# EAGLE schematic OpenAGBoardPart2 (EAGLE 7.5.0)
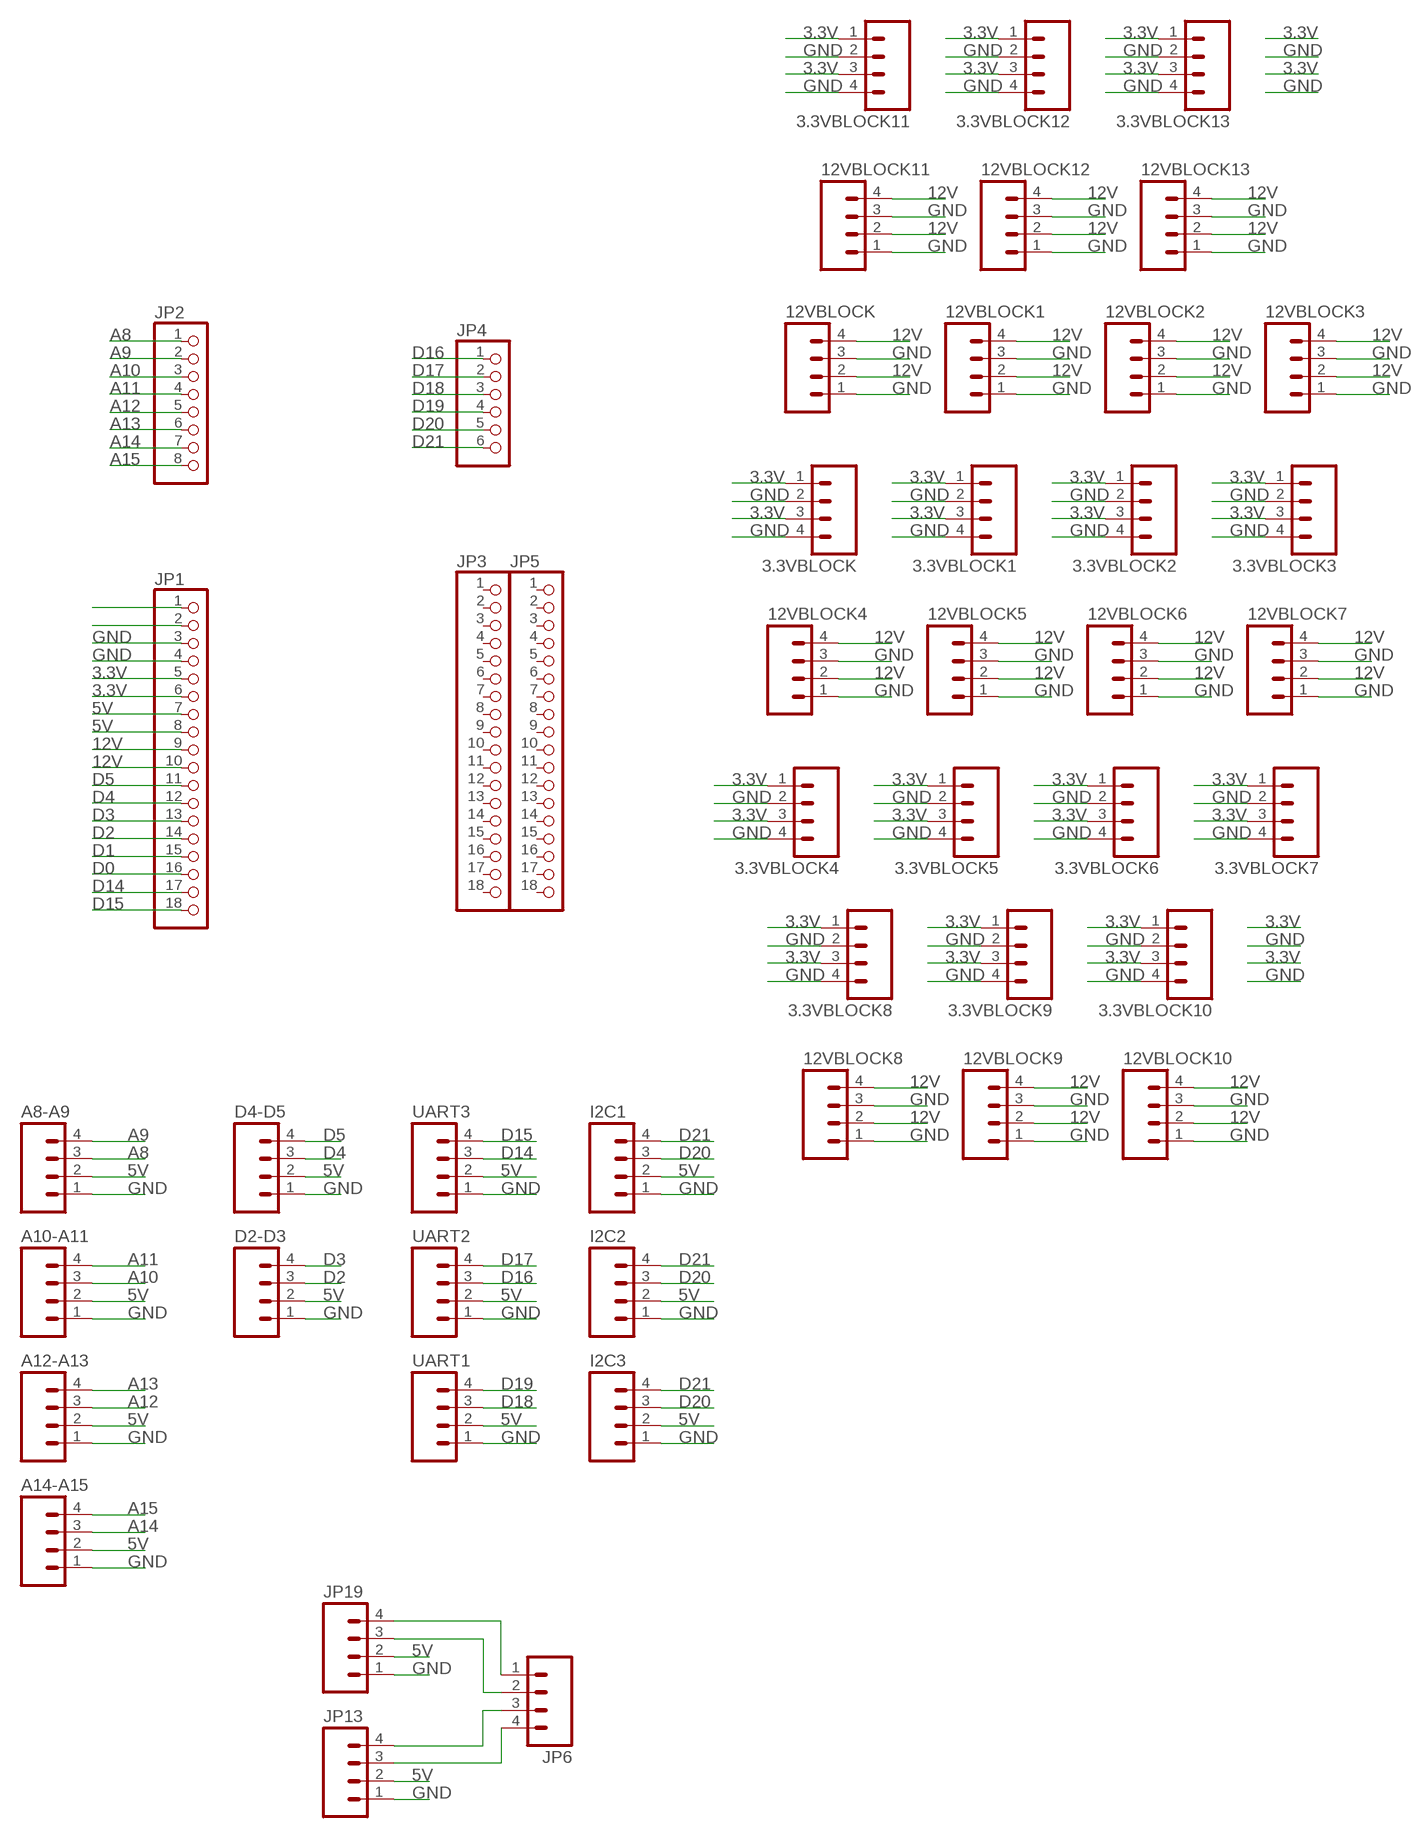
[diagram p0: schematic, sheet 1]

## Parts
3.3VBLOCK  M04NO_SILK_ALL_ROUND  [1X04_NO_SILK_ALL_ROUND]
3.3VBLOCK1  M04NO_SILK_ALL_ROUND  [1X04_NO_SILK_ALL_ROUND]
3.3VBLOCK2  M04NO_SILK_ALL_ROUND  [1X04_NO_SILK_ALL_ROUND]
3.3VBLOCK3  M04NO_SILK_ALL_ROUND  [1X04_NO_SILK_ALL_ROUND]
3.3VBLOCK4  M04NO_SILK_ALL_ROUND  [1X04_NO_SILK_ALL_ROUND]
3.3VBLOCK5  M04NO_SILK_ALL_ROUND  [1X04_NO_SILK_ALL_ROUND]
3.3VBLOCK6  M04NO_SILK_ALL_ROUND  [1X04_NO_SILK_ALL_ROUND]
3.3VBLOCK7  M04NO_SILK_ALL_ROUND  [1X04_NO_SILK_ALL_ROUND]
3.3VBLOCK8  M04NO_SILK_ALL_ROUND  [1X04_NO_SILK_ALL_ROUND]
3.3VBLOCK9  M04NO_SILK_ALL_ROUND  [1X04_NO_SILK_ALL_ROUND]
3.3VBLOCK10  M04NO_SILK_ALL_ROUND  [1X04_NO_SILK_ALL_ROUND]
3.3VBLOCK11  M04NO_SILK_ALL_ROUND  [1X04_NO_SILK_ALL_ROUND]
3.3VBLOCK12  M04NO_SILK_ALL_ROUND  [1X04_NO_SILK_ALL_ROUND]
3.3VBLOCK13  M04NO_SILK_ALL_ROUND  [1X04_NO_SILK_ALL_ROUND]
12VBLOCK  M04NO_SILK_ALL_ROUND  [1X04_NO_SILK_ALL_ROUND]
12VBLOCK1  M04NO_SILK_ALL_ROUND  [1X04_NO_SILK_ALL_ROUND]
12VBLOCK2  M04NO_SILK_ALL_ROUND  [1X04_NO_SILK_ALL_ROUND]
12VBLOCK3  M04NO_SILK_ALL_ROUND  [1X04_NO_SILK_ALL_ROUND]
12VBLOCK4  M04NO_SILK_ALL_ROUND  [1X04_NO_SILK_ALL_ROUND]
12VBLOCK5  M04NO_SILK_ALL_ROUND  [1X04_NO_SILK_ALL_ROUND]
12VBLOCK6  M04NO_SILK_ALL_ROUND  [1X04_NO_SILK_ALL_ROUND]
12VBLOCK7  M04NO_SILK_ALL_ROUND  [1X04_NO_SILK_ALL_ROUND]
12VBLOCK8  M04NO_SILK_ALL_ROUND  [1X04_NO_SILK_ALL_ROUND]
12VBLOCK9  M04NO_SILK_ALL_ROUND  [1X04_NO_SILK_ALL_ROUND]
12VBLOCK10  M04NO_SILK_ALL_ROUND  [1X04_NO_SILK_ALL_ROUND]
12VBLOCK11  M04NO_SILK_ALL_ROUND  [1X04_NO_SILK_ALL_ROUND]
12VBLOCK12  M04NO_SILK_ALL_ROUND  [1X04_NO_SILK_ALL_ROUND]
12VBLOCK13  M04NO_SILK_ALL_ROUND  [1X04_NO_SILK_ALL_ROUND]
A8-A9  M04NO_SILK_ALL_ROUND  [1X04_NO_SILK_ALL_ROUND]
A10-A11  M04NO_SILK_ALL_ROUND  [1X04_NO_SILK_ALL_ROUND]
A12-A13  M04NO_SILK_ALL_ROUND  [1X04_NO_SILK_ALL_ROUND]
A14-A15  M04NO_SILK_ALL_ROUND  [1X04_NO_SILK_ALL_ROUND]
D2-D3  M04NO_SILK_ALL_ROUND  [1X04_NO_SILK_ALL_ROUND]
D4-D5  M04NO_SILK_ALL_ROUND  [1X04_NO_SILK_ALL_ROUND]
I2C1  M04NO_SILK_ALL_ROUND  [1X04_NO_SILK_ALL_ROUND]
I2C2  M04NO_SILK_ALL_ROUND  [1X04_NO_SILK_ALL_ROUND]
I2C3  M04NO_SILK_ALL_ROUND  [1X04_NO_SILK_ALL_ROUND]
JP1  PINHD-1X18-BIG  [1X18-BIG]
JP2  PINHD-1X8BIG  [1X08-BIG]
JP3  PINHD-1X18-BIG  [1X18-BIG]
JP4  PINHD-1X6B  [1X06-BIG]
JP5  PINHD-1X18-BIG  [1X18-BIG]
JP6  M04PTH  [1X04]
JP13  M04NO_SILK_ALL_ROUND  [1X04_NO_SILK_ALL_ROUND]
JP19  M04NO_SILK_ALL_ROUND  [1X04_NO_SILK_ALL_ROUND]
UART1  M04NO_SILK_ALL_ROUND  [1X04_NO_SILK_ALL_ROUND]
UART2  M04NO_SILK_ALL_ROUND  [1X04_NO_SILK_ALL_ROUND]
UART3  M04NO_SILK_ALL_ROUND  [1X04_NO_SILK_ALL_ROUND]

## Nets
3.3V: 3.3VBLOCK1.1 3.3VBLOCK1.3 3.3VBLOCK2.1 3.3VBLOCK2.3 3.3VBLOCK3.1 3.3VBLOCK3.3 3.3VBLOCK4.1 3.3VBLOCK4.3 3.3VBLOCK5.1 3.3VBLOCK5.3 3.3VBLOCK6.1 3.3VBLOCK6.3 3.3VBLOCK7.1 3.3VBLOCK7.3 3.3VBLOCK8.1 3.3VBLOCK8.3 3.3VBLOCK9.1 3.3VBLOCK9.3 3.3VBLOCK10.1 3.3VBLOCK10.3 3.3VBLOCK11.1 3.3VBLOCK11.3 3.3VBLOCK12.1 3.3VBLOCK12.3 3.3VBLOCK13.1 3.3VBLOCK13.3 3.3VBLOCK.1 3.3VBLOCK.3 JP1.5 JP1.6
5V: A8-A9.2 A10-A11.2 A12-A13.2 A14-A15.2 D2-D3.2 D4-D5.2 I2C1.2 I2C2.2 I2C3.2 JP1.7 JP1.8 JP13.2 JP19.2 UART1.2 UART2.2 UART3.2
12V: 12VBLOCK1.2 12VBLOCK1.4 12VBLOCK2.2 12VBLOCK2.4 12VBLOCK3.2 12VBLOCK3.4 12VBLOCK4.2 12VBLOCK4.4 12VBLOCK5.2 12VBLOCK5.4 12VBLOCK6.2 12VBLOCK6.4 12VBLOCK7.2 12VBLOCK7.4 12VBLOCK8.2 12VBLOCK8.4 12VBLOCK9.2 12VBLOCK9.4 12VBLOCK10.2 12VBLOCK10.4 12VBLOCK11.2 12VBLOCK11.4 12VBLOCK12.2 12VBLOCK12.4 12VBLOCK13.2 12VBLOCK13.4 12VBLOCK.2 12VBLOCK.4 JP1.9 JP1.10
A8: A8-A9.3 JP2.1
A9: A8-A9.4 JP2.2
A10: A10-A11.3 JP2.3
A11: A10-A11.4 JP2.4
A12: A12-A13.3 JP2.5
A13: A12-A13.4 JP2.6
A14: A14-A15.3 JP2.7
A15: A14-A15.4 JP2.8
D0: JP1.16
D1: JP1.15
D2: D2-D3.3 JP1.14
D3: D2-D3.4 JP1.13
D4: D4-D5.3 JP1.12
D5: D4-D5.4 JP1.11
D14: JP1.17 UART3.3
D15: JP1.18 UART3.4
D16: JP4.1 UART2.3
D17: JP4.2 UART2.4
D18: JP4.3 UART1.3
D19: JP4.4 UART1.4
D20: I2C1.3 I2C2.3 I2C3.3 JP4.5
D21: I2C1.4 I2C2.4 I2C3.4 JP4.6
GND: 3.3VBLOCK1.2 3.3VBLOCK1.4 3.3VBLOCK2.2 3.3VBLOCK2.4 3.3VBLOCK3.2 3.3VBLOCK3.4 3.3VBLOCK4.2 3.3VBLOCK4.4 3.3VBLOCK5.2 3.3VBLOCK5.4 3.3VBLOCK6.2 3.3VBLOCK6.4 3.3VBLOCK7.2 3.3VBLOCK7.4 3.3VBLOCK8.2 3.3VBLOCK8.4 3.3VBLOCK9.2 3.3VBLOCK9.4 3.3VBLOCK10.2 3.3VBLOCK10.4 3.3VBLOCK11.2 3.3VBLOCK11.4 3.3VBLOCK12.2 3.3VBLOCK12.4 3.3VBLOCK13.2 3.3VBLOCK13.4 3.3VBLOCK.2 3.3VBLOCK.4 12VBLOCK1.1 12VBLOCK1.3 12VBLOCK2.1 12VBLOCK2.3 12VBLOCK3.1 12VBLOCK3.3 12VBLOCK4.1 12VBLOCK4.3 12VBLOCK5.1 12VBLOCK5.3 12VBLOCK6.1 12VBLOCK6.3 12VBLOCK7.1 12VBLOCK7.3 12VBLOCK8.1 12VBLOCK8.3 12VBLOCK9.1 12VBLOCK9.3 12VBLOCK10.1 12VBLOCK10.3 12VBLOCK11.1 12VBLOCK11.3 12VBLOCK12.1 12VBLOCK12.3 12VBLOCK13.1 12VBLOCK13.3 12VBLOCK.1 12VBLOCK.3 A8-A9.1 A10-A11.1 A12-A13.1 A14-A15.1 D2-D3.1 D4-D5.1 I2C1.1 I2C2.1 I2C3.1 JP1.3 JP1.4 JP13.1 JP19.1 UART1.1 UART2.1 UART3.1
N$1: JP1.1
N$2: JP1.2
N$10: JP6.1 JP19.4
N$12: JP6.2 JP19.3
N$15: JP6.3 JP13.4
N$16: JP6.4 JP13.3
Unconnected: JP3.1 JP3.2 JP3.3 JP3.4 JP3.5 JP3.6 JP3.7 JP3.8 JP3.9 JP3.10 JP3.11 JP3.12 JP3.13 JP3.14 JP3.15 JP3.16 JP3.17 JP3.18 JP5.1 JP5.2 JP5.3 JP5.4 JP5.5 JP5.6 JP5.7 JP5.8 JP5.9 JP5.10 JP5.11 JP5.12 JP5.13 JP5.14 JP5.15 JP5.16 JP5.17 JP5.18

## Library data of the parts
3.3VBLOCK 3.3VBLOCK1-3.3VBLOCK13 12VBLOCK 12VBLOCK1-12VBLOCK13 A8-A9 A10-A11 A12-A13 A14-A15 D2-D3 D4-D5 I2C1-I2C3 JP6 JP13 JP19 UART1-UART3 = SparkFun-Connectors:M04: Header 4 Standard 4-pin 0.1" header. Use with straight break away headers (SKU : PRT-00116), right angle break away headers (PRT-00553), swiss pins (PRT-00743), machine pins (PRT-00117), and female headers (PRT-00115). Molex polarized connector foot print use with SKU : PRT-08231 with associated crimp pins and housings. 1MM SMD Version SKU: PRT-10208
JP1 JP3 JP5 = adafruit:PINHD-1X18: PIN HEADER
JP2 = adafruit:PINHD-1X8: PIN HEADER
JP4 = adafruit:PINHD-1X6: PIN HEADER